# Altium project BMW E34T Rear Lights.PrjPcb
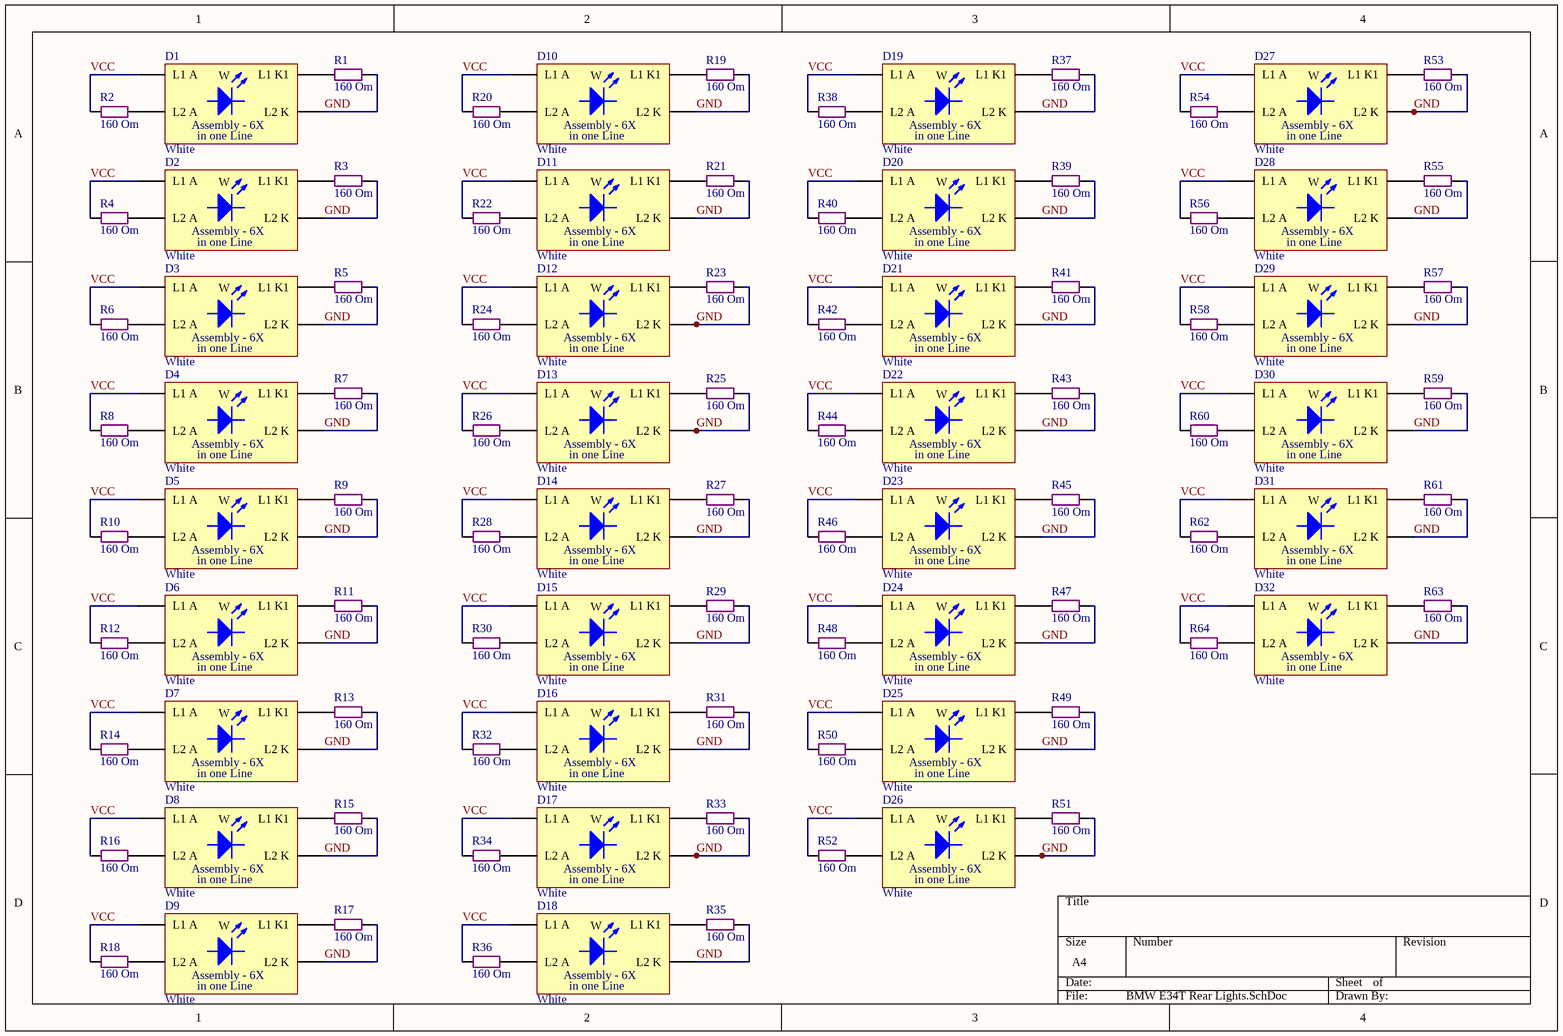
[diagram p0: BMW E34T Rear Lights.SchDoc]
1 sheet, 96 parts. Net scope: global (net labels, ports and power ports of the same name join across sheets).
Board files: BMW E34T Rear Lights v2.PcbDoc, BMW E34T Rear Lights.PcbDoc

## Sheet BMW E34T Rear Lights.SchDoc
size A4

### Parts
D1  White  [LED Assembly Round 5mm White 6X 0.5mm]
D2  White  [LED Assembly Round 5mm White 6X 0.5mm]
D3  White  [LED Assembly Round 5mm White 6X 0.5mm]
D4  White  [LED Assembly Round 5mm White 6X 0.5mm]
D5  White  [LED Assembly Round 5mm White 6X 0.5mm]
D6  White  [LED Assembly Round 5mm White 6X 0.5mm]
D7  White  [LED Assembly Round 5mm White 6X 0.5mm]
D8  White  [LED Assembly Round 5mm White 6X 0.5mm]
D9  White  [LED Assembly Round 5mm White 6X 0.5mm]
D10  White  [LED Assembly Round 5mm White 6X 0.5mm]
D11  White  [LED Assembly Round 5mm White 6X 0.5mm]
D12  White  [LED Assembly Round 5mm White 6X 0.5mm]
D13  White  [LED Assembly Round 5mm White 6X 0.5mm]
D14  White  [LED Assembly Round 5mm White 6X 0.5mm]
D15  White  [LED Assembly Round 5mm White 6X 0.5mm]
D16  White  [LED Assembly Round 5mm White 6X 0.5mm]
D17  White  [LED Assembly Round 5mm White 6X 0.5mm]
D18  White  [LED Assembly Round 5mm White 6X 0.5mm]
D19  White  [LED Assembly Round 5mm White 6X 0.5mm]
D20  White  [LED Assembly Round 5mm White 6X 0.5mm]
D21  White  [LED Assembly Round 5mm White 6X 0.5mm]
D22  White  [LED Assembly Round 5mm White 6X 0.5mm]
D23  White  [LED Assembly Round 5mm White 6X 0.5mm]
D24  White  [LED Assembly Round 5mm White 6X 0.5mm]
D25  White  [LED Assembly Round 5mm White 6X 0.5mm]
D26  White  [LED Assembly Round 5mm White 6X 0.5mm]
D27  White  [LED Assembly Round 5mm White 6X 0.5mm]
D28  White  [LED Assembly Round 5mm White 6X 0.5mm]
D29  White  [LED Assembly Round 5mm White 6X 0.5mm]
D30  White  [LED Assembly Round 5mm White 6X 0.5mm]
D31  White  [LED Assembly Round 5mm White 6X 0.5mm]
D32  White  [LED Assembly Round 5mm White 6X 0.5mm]
R1  160 Om  [SMD 0805 (2012)]
R2  160 Om  [SMD 0805 (2012)]
R3  160 Om  [SMD 0805 (2012)]
R4  160 Om  [SMD 0805 (2012)]
R5  160 Om  [SMD 0805 (2012)]
R6  160 Om  [SMD 0805 (2012)]
R7  160 Om  [SMD 0805 (2012)]
R8  160 Om  [SMD 0805 (2012)]
R9  160 Om  [SMD 0805 (2012)]
R10  160 Om  [SMD 0805 (2012)]
R11  160 Om  [SMD 0805 (2012)]
R12  160 Om  [SMD 0805 (2012)]
R13  160 Om  [SMD 0805 (2012)]
R14  160 Om  [SMD 0805 (2012)]
R15  160 Om  [SMD 0805 (2012)]
R16  160 Om  [SMD 0805 (2012)]
R17  160 Om  [SMD 0805 (2012)]
R18  160 Om  [SMD 0805 (2012)]
R19  160 Om  [SMD 0805 (2012)]
R20  160 Om  [SMD 0805 (2012)]
R21  160 Om  [SMD 0805 (2012)]
R22  160 Om  [SMD 0805 (2012)]
R23  160 Om  [SMD 0805 (2012)]
R24  160 Om  [SMD 0805 (2012)]
R25  160 Om  [SMD 0805 (2012)]
R26  160 Om  [SMD 0805 (2012)]
R27  160 Om  [SMD 0805 (2012)]
R28  160 Om  [SMD 0805 (2012)]
R29  160 Om  [SMD 0805 (2012)]
R30  160 Om  [SMD 0805 (2012)]
R31  160 Om  [SMD 0805 (2012)]
R32  160 Om  [SMD 0805 (2012)]
R33  160 Om  [SMD 0805 (2012)]
R34  160 Om  [SMD 0805 (2012)]
R35  160 Om  [SMD 0805 (2012)]
R36  160 Om  [SMD 0805 (2012)]
R37  160 Om  [SMD 0805 (2012)]
R38  160 Om  [SMD 0805 (2012)]
R39  160 Om  [SMD 0805 (2012)]
R40  160 Om  [SMD 0805 (2012)]
R41  160 Om  [SMD 0805 (2012)]
R42  160 Om  [SMD 0805 (2012)]
R43  160 Om  [SMD 0805 (2012)]
R44  160 Om  [SMD 0805 (2012)]
R45  160 Om  [SMD 0805 (2012)]
R46  160 Om  [SMD 0805 (2012)]
R47  160 Om  [SMD 0805 (2012)]
R48  160 Om  [SMD 0805 (2012)]
R49  160 Om  [SMD 0805 (2012)]
R50  160 Om  [SMD 0805 (2012)]
R51  160 Om  [SMD 0805 (2012)]
R52  160 Om  [SMD 0805 (2012)]
R53  160 Om  [SMD 0805 (2012)]
R54  160 Om  [SMD 0805 (2012)]
R55  160 Om  [SMD 0805 (2012)]
R56  160 Om  [SMD 0805 (2012)]
R57  160 Om  [SMD 0805 (2012)]
R58  160 Om  [SMD 0805 (2012)]
R59  160 Om  [SMD 0805 (2012)]
R60  160 Om  [SMD 0805 (2012)]
R61  160 Om  [SMD 0805 (2012)]
R62  160 Om  [SMD 0805 (2012)]
R63  160 Om  [SMD 0805 (2012)]
R64  160 Om  [SMD 0805 (2012)]

### Nets
GND: D1.K2(L2_K) D2.K2(L2_K) D3.K2(L2_K) D4.K2(L2_K) D5.K2(L2_K) D6.K2(L2_K) D7.K2(L2_K) D8.K2(L2_K) D9.K2(L2_K) D10.K2(L2_K) D11.K2(L2_K) D12.K2(L2_K) D13.K2(L2_K) D14.K2(L2_K) D15.K2(L2_K) D16.K2(L2_K) D17.K2(L2_K) D18.K2(L2_K) D19.K2(L2_K) D20.K2(L2_K) D21.K2(L2_K) D22.K2(L2_K) D23.K2(L2_K) D24.K2(L2_K) D25.K2(L2_K) D26.K2(L2_K) D27.K2(L2_K) D28.K2(L2_K) D29.K2(L2_K) D30.K2(L2_K) D31.K2(L2_K) D32.K2(L2_K) R1.2 R3.2 R5.2 R7.2 R9.2 R11.2 R13.2 R15.2 R17.2 R19.2 R21.2 R23.2 R25.2 R27.2 R29.2 R31.2 R33.2 R35.2 R37.2 R39.2 R41.2 R43.2 R45.2 R47.2 R49.2 R51.2 R53.2 R55.2 R57.2 R59.2 R61.2 R63.2
VCC: D1.A1(L1_A) D2.A1(L1_A) D3.A1(L1_A) D4.A1(L1_A) D5.A1(L1_A) D6.A1(L1_A) D7.A1(L1_A) D8.A1(L1_A) D9.A1(L1_A) D10.A1(L1_A) D11.A1(L1_A) D12.A1(L1_A) D13.A1(L1_A) D14.A1(L1_A) D15.A1(L1_A) D16.A1(L1_A) D17.A1(L1_A) D18.A1(L1_A) D19.A1(L1_A) D20.A1(L1_A) D21.A1(L1_A) D22.A1(L1_A) D23.A1(L1_A) D24.A1(L1_A) D25.A1(L1_A) D26.A1(L1_A) D27.A1(L1_A) D28.A1(L1_A) D29.A1(L1_A) D30.A1(L1_A) D31.A1(L1_A) D32.A1(L1_A) R2.1 R4.1 R6.1 R8.1 R10.1 R12.1 R14.1 R16.1 R18.1 R20.1 R22.1 R24.1 R26.1 R28.1 R30.1 R32.1 R34.1 R36.1 R38.1 R40.1 R42.1 R44.1 R46.1 R48.1 R50.1 R52.1 R54.1 R56.1 R58.1 R60.1 R62.1 R64.1
NetD1_A2: D1.A2(L2_A) R2.2
NetD1_K1: D1.K1(L1_K1) R1.1
NetD2_A2: D2.A2(L2_A) R4.2
NetD2_K1: D2.K1(L1_K1) R3.1
NetD3_A2: D3.A2(L2_A) R6.2
NetD3_K1: D3.K1(L1_K1) R5.1
NetD4_A2: D4.A2(L2_A) R8.2
NetD4_K1: D4.K1(L1_K1) R7.1
NetD5_A2: D5.A2(L2_A) R10.2
NetD5_K1: D5.K1(L1_K1) R9.1
NetD6_A2: D6.A2(L2_A) R12.2
NetD6_K1: D6.K1(L1_K1) R11.1
NetD7_A2: D7.A2(L2_A) R14.2
NetD7_K1: D7.K1(L1_K1) R13.1
NetD8_A2: D8.A2(L2_A) R16.2
NetD8_K1: D8.K1(L1_K1) R15.1
NetD9_A2: D9.A2(L2_A) R18.2
NetD9_K1: D9.K1(L1_K1) R17.1
NetD10_A2: D10.A2(L2_A) R20.2
NetD10_K1: D10.K1(L1_K1) R19.1
NetD11_A2: D11.A2(L2_A) R22.2
NetD11_K1: D11.K1(L1_K1) R21.1
NetD12_A2: D12.A2(L2_A) R24.2
NetD12_K1: D12.K1(L1_K1) R23.1
NetD13_A2: D13.A2(L2_A) R26.2
NetD13_K1: D13.K1(L1_K1) R25.1
NetD14_A2: D14.A2(L2_A) R28.2
NetD14_K1: D14.K1(L1_K1) R27.1
NetD15_A2: D15.A2(L2_A) R30.2
NetD15_K1: D15.K1(L1_K1) R29.1
NetD16_A2: D16.A2(L2_A) R32.2
NetD16_K1: D16.K1(L1_K1) R31.1
NetD17_A2: D17.A2(L2_A) R34.2
NetD17_K1: D17.K1(L1_K1) R33.1
NetD18_A2: D18.A2(L2_A) R36.2
NetD18_K1: D18.K1(L1_K1) R35.1
NetD19_A2: D19.A2(L2_A) R38.2
NetD19_K1: D19.K1(L1_K1) R37.1
NetD20_A2: D20.A2(L2_A) R40.2
NetD20_K1: D20.K1(L1_K1) R39.1
NetD21_A2: D21.A2(L2_A) R42.2
NetD21_K1: D21.K1(L1_K1) R41.1
NetD22_A2: D22.A2(L2_A) R44.2
NetD22_K1: D22.K1(L1_K1) R43.1
NetD23_A2: D23.A2(L2_A) R46.2
NetD23_K1: D23.K1(L1_K1) R45.1
NetD24_A2: D24.A2(L2_A) R48.2
NetD24_K1: D24.K1(L1_K1) R47.1
NetD25_A2: D25.A2(L2_A) R50.2
NetD25_K1: D25.K1(L1_K1) R49.1
NetD26_A2: D26.A2(L2_A) R52.2
NetD26_K1: D26.K1(L1_K1) R51.1
NetD27_A2: D27.A2(L2_A) R54.2
NetD27_K1: D27.K1(L1_K1) R53.1
NetD28_A2: D28.A2(L2_A) R56.2
NetD28_K1: D28.K1(L1_K1) R55.1
NetD29_A2: D29.A2(L2_A) R58.2
NetD29_K1: D29.K1(L1_K1) R57.1
NetD30_A2: D30.A2(L2_A) R60.2
NetD30_K1: D30.K1(L1_K1) R59.1
NetD31_A2: D31.A2(L2_A) R62.2
NetD31_K1: D31.K1(L1_K1) R61.1
NetD32_A2: D32.A2(L2_A) R64.2
NetD32_K1: D32.K1(L1_K1) R63.1

### Notes on the sheet
- (in symbol Led Assembly Round 5mm White 6X) W; Assembly - 6X; in one Line

### Library data of the parts
D1-D32 = Led Assembly Round 5mm White 6X: 3.2-3.4v 25mA, 16-20cd; Forward Voltage Min: 3.2; Forward Voltage TYP: 3.4; Wave len min/typ: 5000/6500; Liminous Min (mcd): 16000; Liminous Typ (mcd): 20000; Forward Amp (mA): 25; Color: White
R1-R64 = Res SMD 0805